# EAGLE design closed-loop-control-v2 (EAGLE 7.7.0)
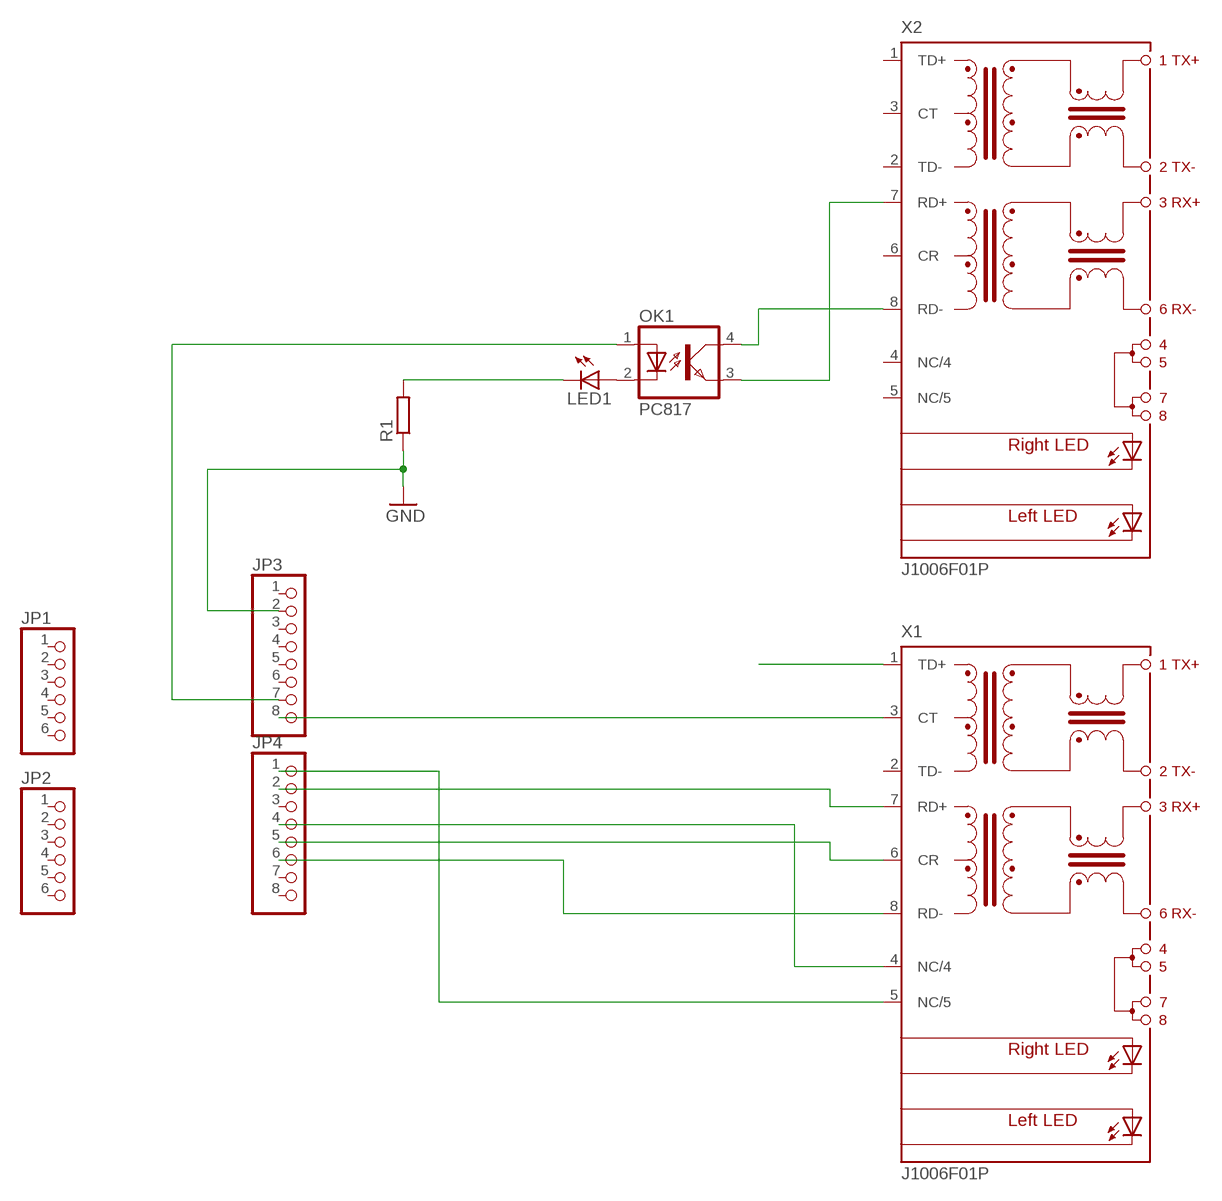
[diagram p0: schematic, sheet 1]

## Parts
JP1  PINHD-1X6  [1X06]
JP2  PINHD-1X6  [1X06]
JP3  PINHD-1X8  [1X08]
JP4  PINHD-1X8  [1X08]
LED1  LED3MM  [LED3MM]
OK1  PC817  [DIL04]
R1  R-EU_0207/10  [0207/10]
X1  J1006F01P  [J1]
X2  J1006F01P  [J1]

## Nets
COUNT-X: JP4.6 X1.8(RD-)
COUNT-Y: JP4.5 X1.6(CR)
COUNT-Z [power]: JP4.4 X1.4(NC/4)
DIR-X: JP4.2 X1.7(RD+)
DIR-Y: JP4.1 X1.5(NC/5)
DIR-Z: JP3.8 X1.3(CT)
GND: JP3.2 R1.1 X1.1(TD+)
LASER-TTL [power]: OK1.4(COL) X2.8(RD-)
LASER-TTL-CMD: JP3.7 OK1.1(A)
LASER-TTL-GND: OK1.3(EMIT) X2.7(RD+)
N$3: LED1.A OK1.2(C)
N$4: LED1.K(C) R1.2
Unconnected: JP1.1 JP1.2 JP1.3 JP1.4 JP1.5 JP1.6 JP2.1 JP2.2 JP2.3 JP2.4 JP2.5 JP2.6 JP3.1 JP3.3 JP3.4 JP3.5 JP3.6 JP4.3 JP4.7 JP4.8 X1.2(TD-) X2.1(TD+) X2.2(TD-) X2.3(CT) X2.4(NC/4) X2.5(NC/5) X2.6(CR)

## Library data of the parts
JP1 JP2 = pinhead:PINHD-1X6: PIN HEADER
JP3 JP4 = pinhead:PINHD-1X8: PIN HEADER
LED1 = led:LED: LED OSRAM: - CHIPLED LG R971, LG N971, LY N971, LG Q971, LY Q971, LO R971, LY R971 LH N974, LH R974 LS Q976, LO Q976, LY Q976 LO Q996 - Hyper CHIPLED LW Q18S LB Q993, LB Q99A, LB R99A - SideLED LS A670, LO A670, LY A670, LG A670, LP A670 LB A673, LV A673, LT A673, LW A673 LH A674 LY A675 LS A676, LA A676, LO A676, LY A676, LW A676 LS A679, LY A679, LG A679 - Hyper Micro SIDELED® LS Y876, LA Y876, LO Y876, LY Y876 LT Y87S - SmartLED LW L88C, LW L88S LB L89C, LB L89S, LG L890 LS L89K, LO L89K, LY L89K LS L896, LA L896, LO L896, LY L896 - TOPLED LS T670, LO T670, LY T670, LG T670, LP T670 LSG T670, LSP T670, LSY T670, LOP T670, LYG T670 LG T671, LOG T671, LSG T671 LB T673, LV T673, LT T673, LW T673 LH T674 LS T676, LA T676, LO T676, LY T676, LB T676, LH T676, LSB T676, LW T676 LB T67C, LV T67C, LT T67C, LS T67K, LO T67K, LY T67K, LW E67C LS E67B, LA E67B, LO E67B, LY E67B, LB E67C, LV E67C, LT E67C LW T67C LS T679, LY T679, LG T679 LS T770, LO T770, LY T770, LG T770, LP T770 LB T773, LV T773, LT T773, LW T773 LH T774 LS E675, LA E675, LY E675, LS T675 LS T776, LA T776, LO T776, LY T776, LB T776 LHGB T686 LT T68C, LB T68C - Hyper Mini TOPLED® LB M676 - Mini TOPLED Santana® LG M470 LS M47K, LO M47K, LY M47K Source: http://www.osram.convergy.de LUXEON: - LUMILED® LXK2-PW12-R00, LXK2-PW12-S00, LXK2-PW14-U00, LXK2-PW14-V00 LXK2-PM12-R00, LXK2-PM12-S00, LXK2-PM14-U00 LXK2-PE12-Q00, LXK2-PE12-R00, LXK2-PE12-S00, LXK2-PE14-T00, LXK2-PE14-U00 LXK2-PB12-K00, LXK2-PB12-L00, LXK2-PB12-M00, LXK2-PB14-N00, LXK2-PB14-P00, LXK2-PB14-Q00 LXK2-PR12-L00, LXK2-PR12-M00, LXK2-PR14-Q00, LXK2-PR14-R00 LXK2-PD12-Q00, LXK2-PD12-R00, LXK2-PD12-S00 LXK2-PH12-R00, LXK2-PH12-S00 LXK2-PL12-P00, LXK2-PL12-Q00, LXK2-PL12-R00 Source: www.luxeon.com KINGBRIGHT: KA-3528ASYC Source: www.kingbright.com
OK1 = optocoupler:PC817: SHARP OPTO COUPLER; MPN: PC817X4J000F; OC_FARNELL: 9707727; OC_NEWARK: 97K7059
R1 = resistor:R-EU_: RESISTOR, European symbol
X1 X2 = con-pulse:J1006F01P: PULSEJACK (TM) 1x1 Tab-UP RJ45 10/100 Base-TX RJ45 1x1 Tab-UP with LEDs 8-pin (J1 series) and 6-pin (JP series) integrated magnetics connector, designed to support applications, such as ADSL modems, LAN-on-Motherboard, and Hub and Switches. Source: www.pulseeng.com .. PulseJack-J402.pdf; OC_FARNELL: unknown; OC_NEWARK: unknown

## Net classes
0 default: width 1 mm, drill 0.9 mm, clearance 0.3 mm
1 power: width 1.27 mm, drill 0.8 mm, clearance 0.1 mm

## Board
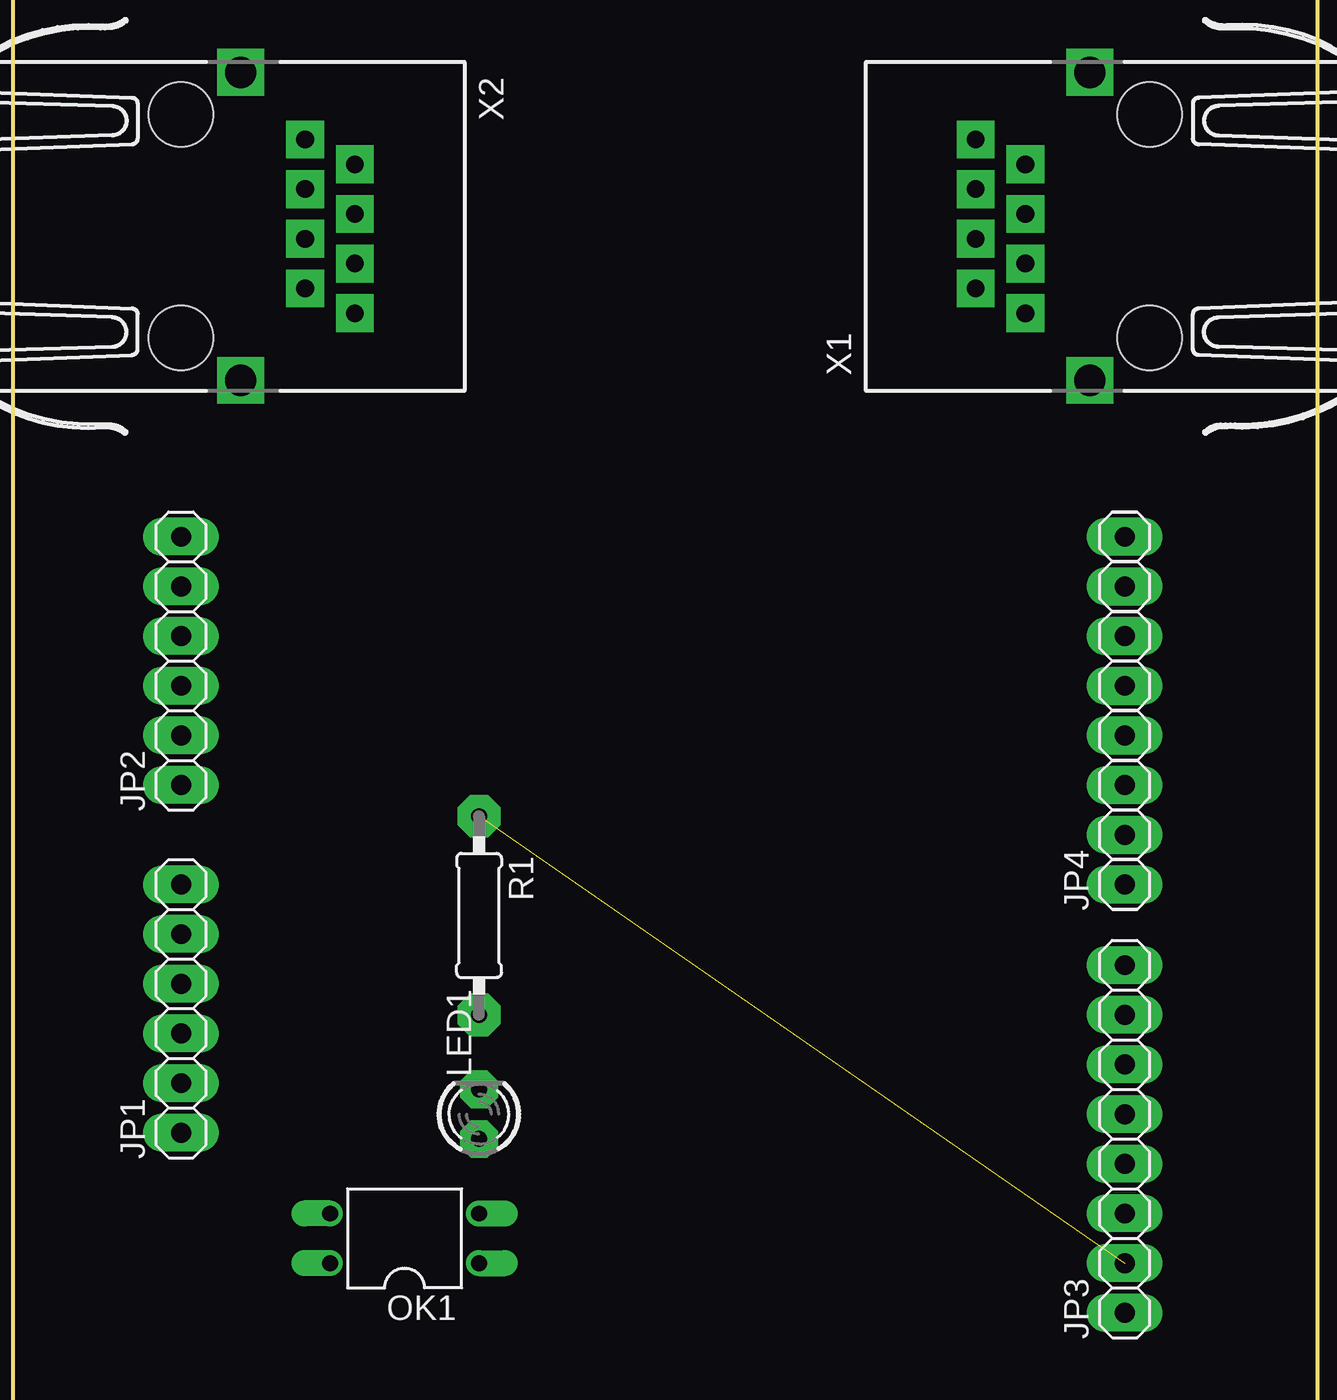
[diagram p1: board, top side]
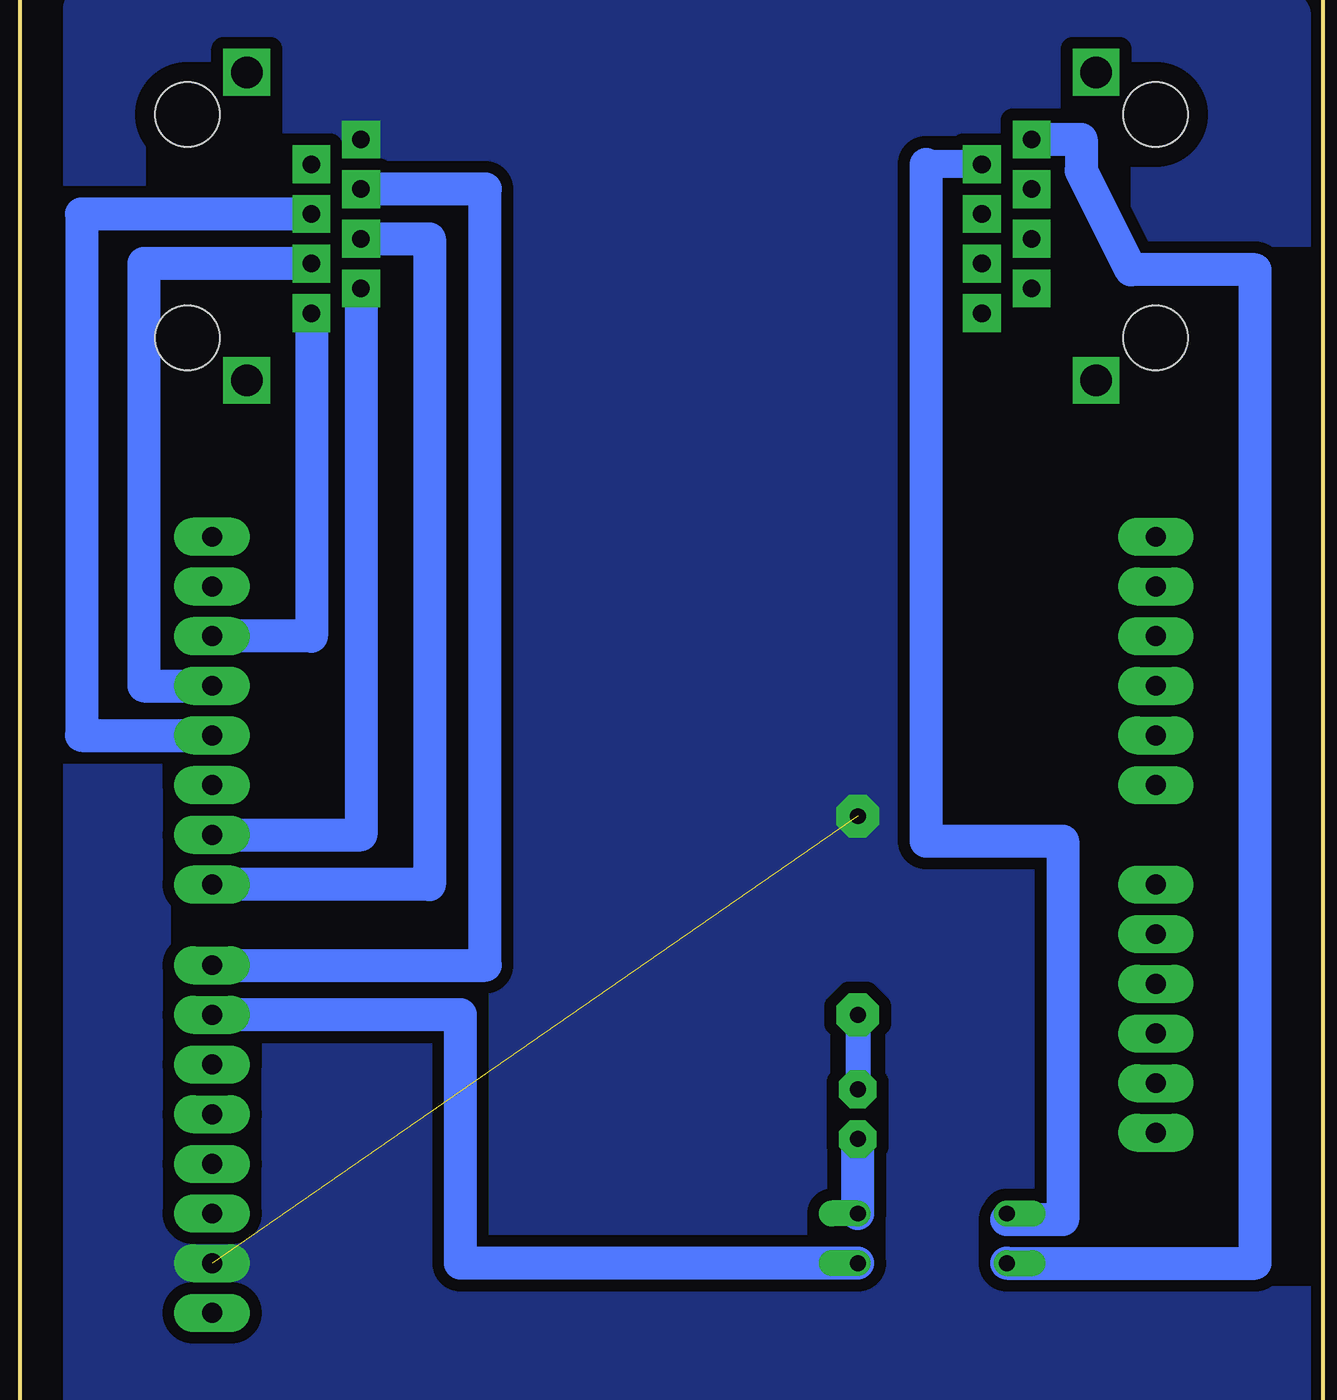
[diagram p2: board, bottom side, seen from below]

No outline drawn. Coordinates in mm, seen from the top.
Copper layers (1*16): Top 0.035mm / dielectric 1.5mm / Bottom 0.035mm
Design rules "default": minimum track width 10mil, minimum drill 24mil, track to track 8mil, track to pad 8mil, pad to pad 8mil, via to via 8mil, smd to smd 8mil, copper to edge 40mil, drill to drill 8mil, minimum pad ring 10mil, minimum via ring 8mil, stop-mask expansion 4mil, vias tented up to drill 0mil, thermal gap 10mil
Milling: 4 lines

### Footprints (pad centres in the part's own frame; a part is rotated, then mirrored left to right if it is on the bottom)
1X08 = drill 1.016 pad 1.93 long: 1 -8.89,0; 2 -6.35,0; 3 -3.81,0; 4 -1.27,0; 5 1.27,0; 6 3.81,0; 7 6.35,0; 8 8.89,0
1X06 = drill 1.016 pad 1.93 long: 1 -6.35,0; 2 -3.81,0; 3 -1.27,0; 4 1.27,0; 5 3.81,0; 6 6.35,0
LED3MM = drill 0.813 pad 1.93 octagon: A -1.27,0; K 1.27,0
DIL04 = drill 0.813 offset: 1 -1.27,-3.81; 2 1.27,-3.81; 3 1.27,3.81; 4 -1.27,3.81
0207/10 = drill 0.813 pad 2.184 octagon: 1 -5.08,0; 2 5.08,0
J1 = drill 0.9 pad 1.93 square: 1 4.445,2.54; 2 3.175,0; 3 1.905,2.54; 4 0.635,0; 5 -0.635,2.54; 6 -1.905,0; 7 -3.175,2.54; 8 -4.445,0 | drill 1.6 pad 2.184 square: M1 -7.875,-3.3; M2 7.875,-3.3 | hole 3.3: 5.715,-6.35; -5.715,-6.35

### Placement (x,y rotation side)
IOL1  [1X08]  57.15,37.15 270 top
JP1  8.89,21.91 90 top
JP2  8.89,39.69 90 top
JP3  57.15,15.24 90 top
JP4  57.15,37.15 90 top
LED1  24.13,16.51 90 top
OK1  20.32,10.16 90 top
R1  24.13,26.67 270 top
X1  52.07,61.91 90 top
X2  15.24,61.91 270 top

### Tracks (layer width: path | path; a pad name or v marks a point on that pad's centre or on a via)
COUNT-X
  Bottom 1.676: X1.8 52.07,40.96 JP4.6
COUNT-Y
  Bottom 1.676: JP4.5 60.64,38.42 60.64,60.01 X1.6
COUNT-Z
  Bottom 1.676: JP4.4 63.82,35.88 63.82,62.55 X1.4
DIR-X
  Bottom 1.676: JP4.2 49.53,30.8 X1.7
DIR-Y
  Bottom 1.676: X1.5 46.04,61.28 46.04,28.26 JP4.1
DIR-Z
  Bottom 1.676: JP3.8 43.18,24.13 43.18,63.82 X1.3
GND  (1 unrouted)
  pour Bottom (isolate 0.61): 2.22,72.71 63.5,73.03 63.5,1.91 2.22,1.59
LASER-TTL
  Bottom 1.676: OK1.4 3.81,8.89 3.81,59.69 10.16,59.69 12.7,64.77 12.7,66.36 X2.8
LASER-TTL-CMD
  Bottom 1.676: OK1.1 44.45,8.89 44.45,21.59 JP3.7
LASER-TTL-GND
  Bottom 0.406: 16.51,11.11 OK1.3
  Bottom 1.422: X2.7 20.64,65.09
  Bottom 1.676: 20.64,65.09 20.64,30.48 13.65,30.48 13.65,11.11 16.51,11.11
N$3
  Bottom 1.676: OK1.2 LED1.A
N$4
  Bottom 1.27: R1.2 LED1.K